# EasyEDA schematic BTS7960-Breakout-Board.json
TITLE: BTS7960-Breakout-Board; REV: B.00.01; Date: 2024-02-04; Sheet: 1/1; Drawn By: helmut-f; Company: Your Company
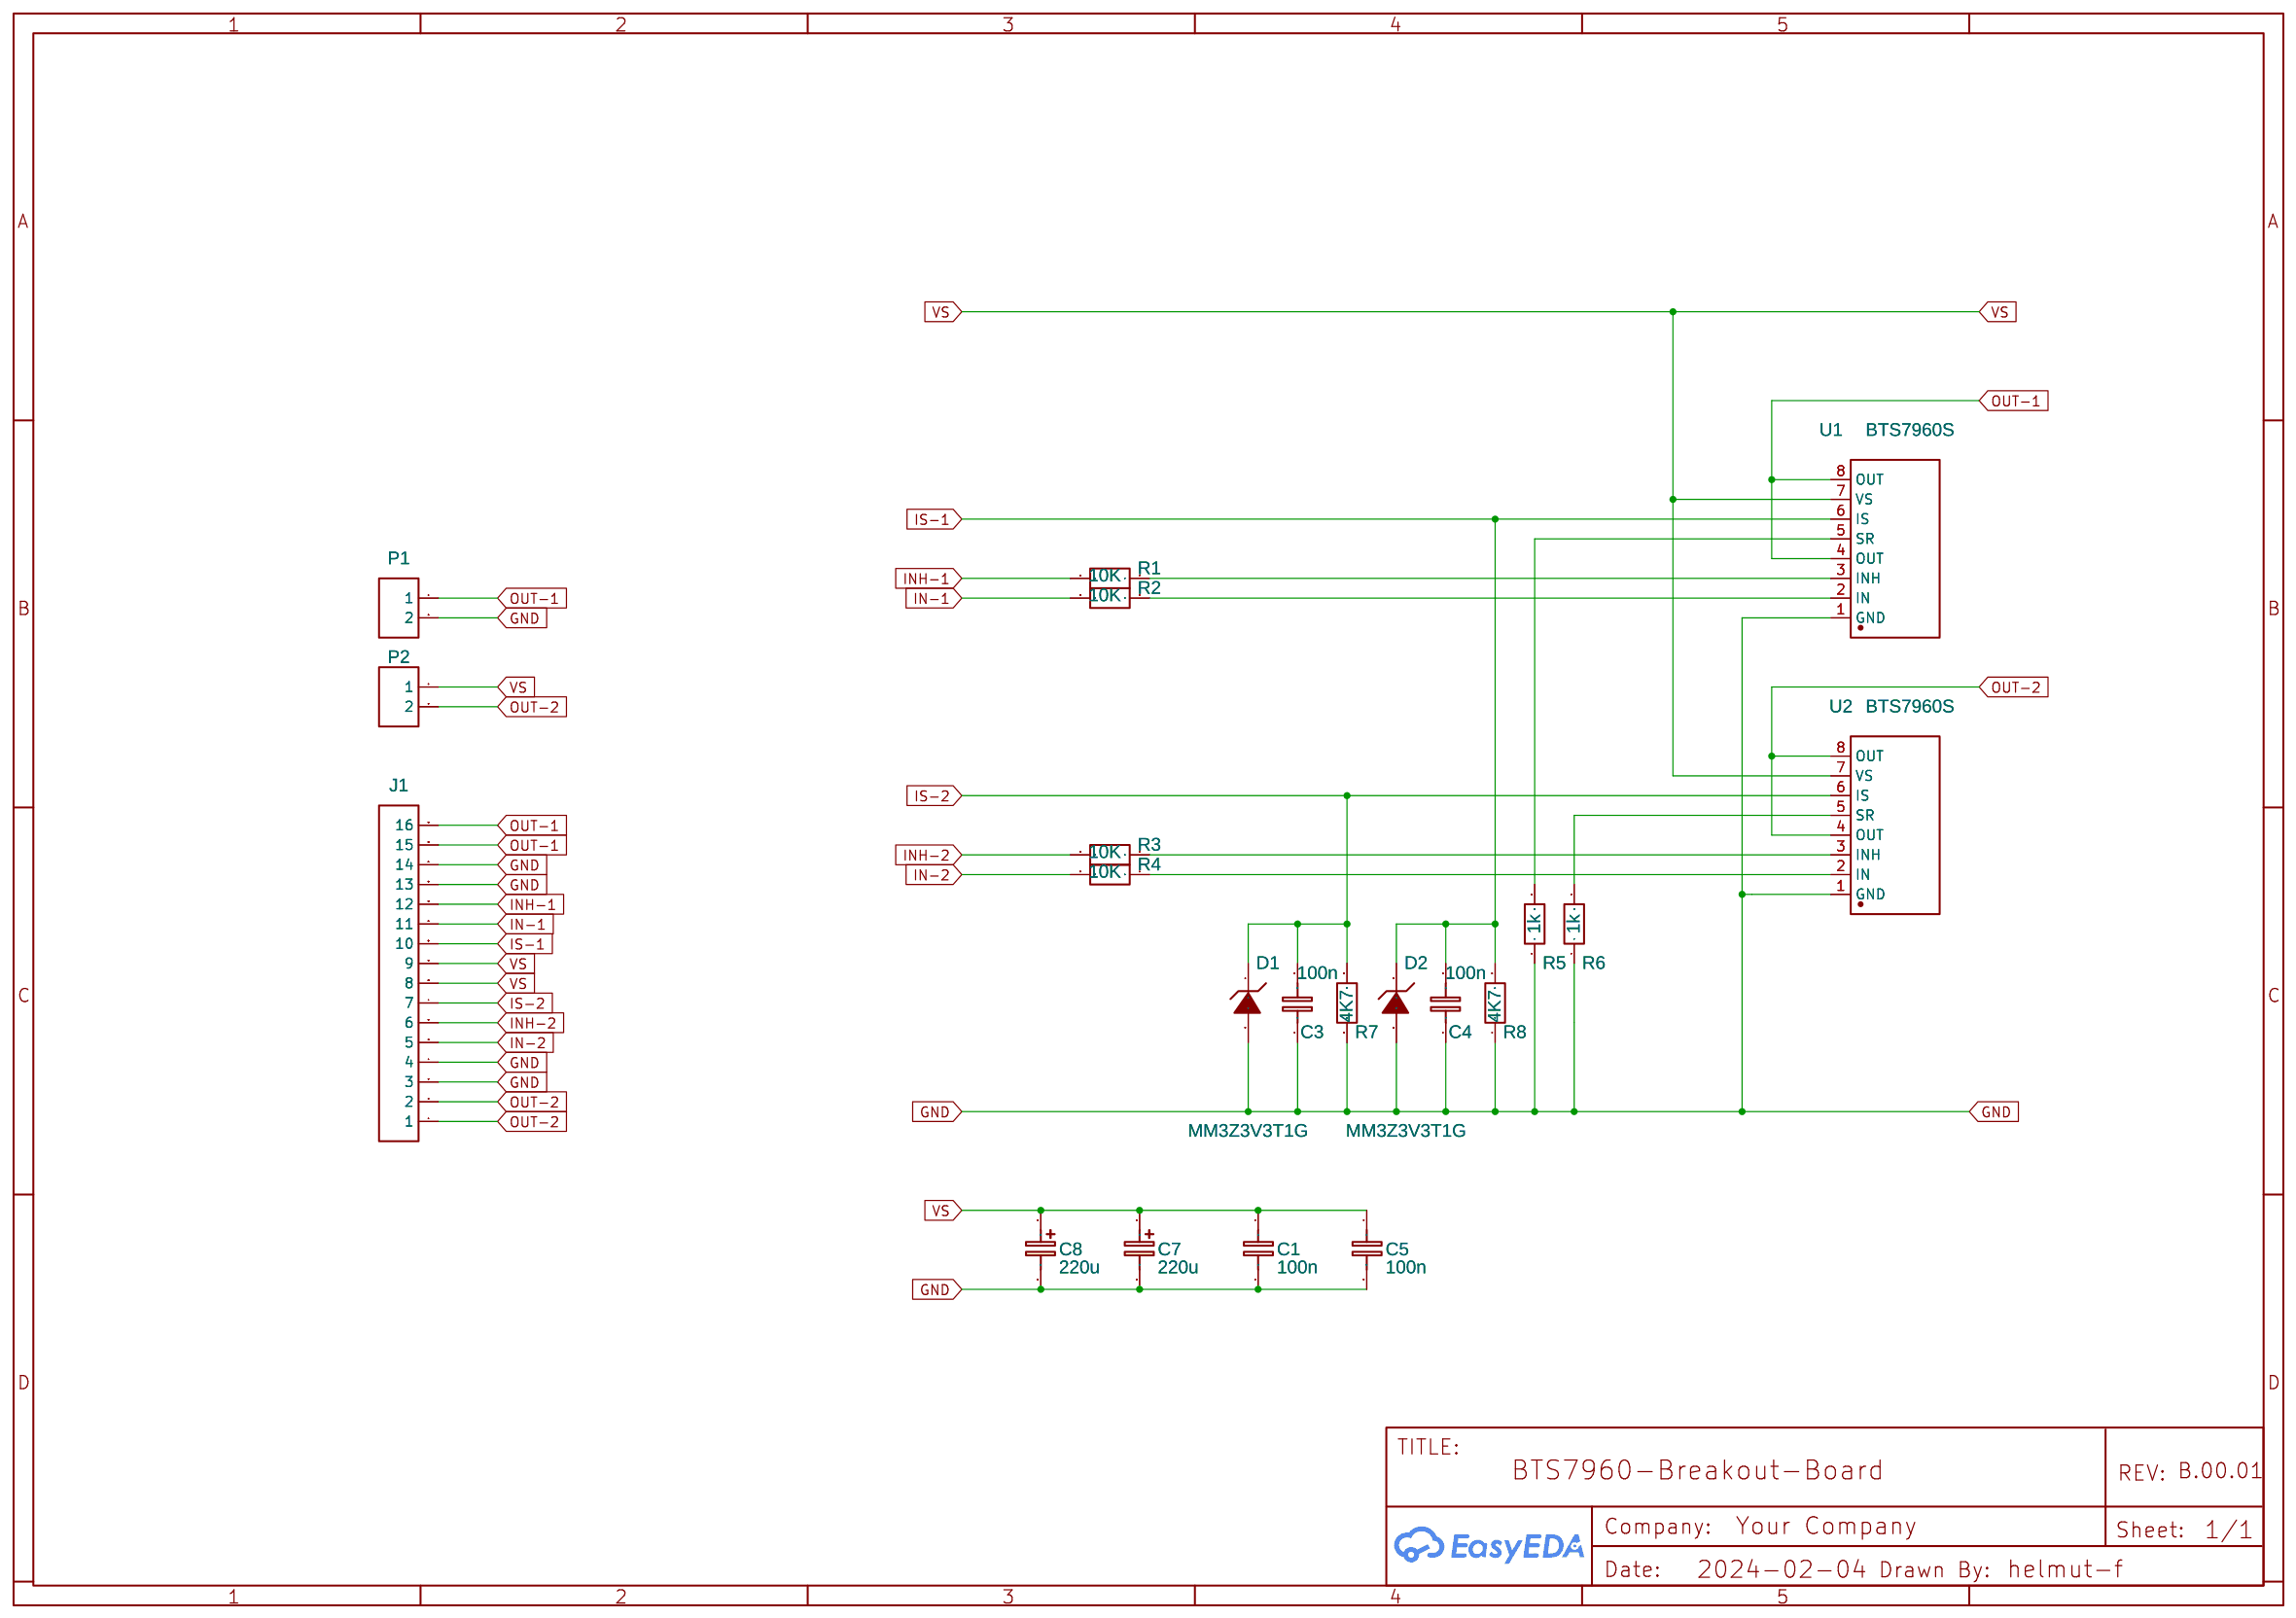
[diagram p0: schematic sheet]

## Parts
C1  100n  [C1206]
C3  100n  [C1206]
C4  100n  [C1206]
C5  100n  [C1206]
C7  220u  [CAP-D8.0-H10.5]
C8  220u  [CAP-D8.0-H10.5]
D1  MM3Z3V3T1G  [SOD-323_L1.8-W1.3-LS2.5-RD]
D2  MM3Z3V3T1G  [SOD-323_L1.8-W1.3-LS2.5-RD]
J1  HDR-M-2.54_1x16  [HDR-M-2.54_1X16]
P1  CONN-TH_2P-P5.08  [CONN-TH_2P-P5.08]
P2  CONN-TH_2P-P5.08  [CONN-TH_2P-P5.08]
R1  10K  [R1206]
R2  10K  [R1206]
R3  10K  [R1206]
R4  10K  [R1206]
R5  1k  [R1206]
R6  1k  [R1206]
R7  4K7  [R1206]
R8  4K7  [R1206]
U1  BTS7960S  [PG-TO263-7_L9.9-W9.2-P1.27-LS14.9-BR]
U2  BTS7960S  [PG-TO263-7_L9.9-W9.2-P1.27-LS14.9-BR]

## Library data of the parts
C1 C3-C5 = C_0603_EU: Contributor: LCEDA_Lib
C7 C8 = CE_SMD_D5.0×H5.5_EU: Contributor: LCEDA_Lib
D1 D2 = MM3Z3V3T1G: Supplier: LCSC; Manufacturer: onsemi(安森美); Supplier Part: C75073; JLCPCB Part Class: Extended Part
J1 = HDR-M-2.54_1x16: Supplier: LCSC; Contributor: LCEDA_Lib
P1 P2 = CONN-TH_2P-P5.08: Supplier: LCSC; Contributor: LCEDA_Lib
R1 R3-R8 = R_AXIAL-0.3_EU: Contributor: LCEDA_Lib
R2 = R_AXIAL-0.3_EU: Contributor: LCEDA_Lib; Package Display: No
U1 U2 = BTS7960S: Contributor: LCSC; Supplier: LCSC; Supplier Part: C9900000198; Manufacturer: null; Manufacturer Part: bts7960S; JLCPCB Part Class: Extended Part

## Nets
GND: C1.2 C3.1 C4.1 C5.2 C7.2 C8.2 D1.2(A) D2.2(A) J1.3 J1.4 J1.13 J1.14 P1.2 R5.1 R6.1 R7.1 R8.1 U1.1(GND) U2.1(GND)
IN-1: J1.11 R2.2
IN-2: J1.5 R4.2
INH-1: J1.12 R1.2
INH-2: J1.6 R3.2
IS-1: C4.2 D2.1(K) J1.10 R8.2 U1.6(IS)
IS-2: C3.2 D1.1(K) J1.7 R7.2 U2.6(IS)
OUT-1: J1.15 J1.16 P1.1 U1.4(OUT) U1.8(OUT)
OUT-2: J1.1 J1.2 P2.2 U2.4(OUT) U2.8(OUT)
VS: C1.1 C5.1 C7.1 C8.1 J1.8 J1.9 P2.1 U1.7(VS) U2.7(VS)
Net-(R1-1): R1.1 U1.3(INH)
Net-(R2-1): R2.1 U1.2(IN)
Net-(R3-1): R3.1 U2.3(INH)
Net-(R4-1): R4.1 U2.2(IN)
Net-(R5-2): R5.2 U1.5(SR)
Net-(R6-2): R6.2 U2.5(SR)
